# EAGLE design SAME54-board (EAGLE 9.6.2)

## Sheet 1 of 3
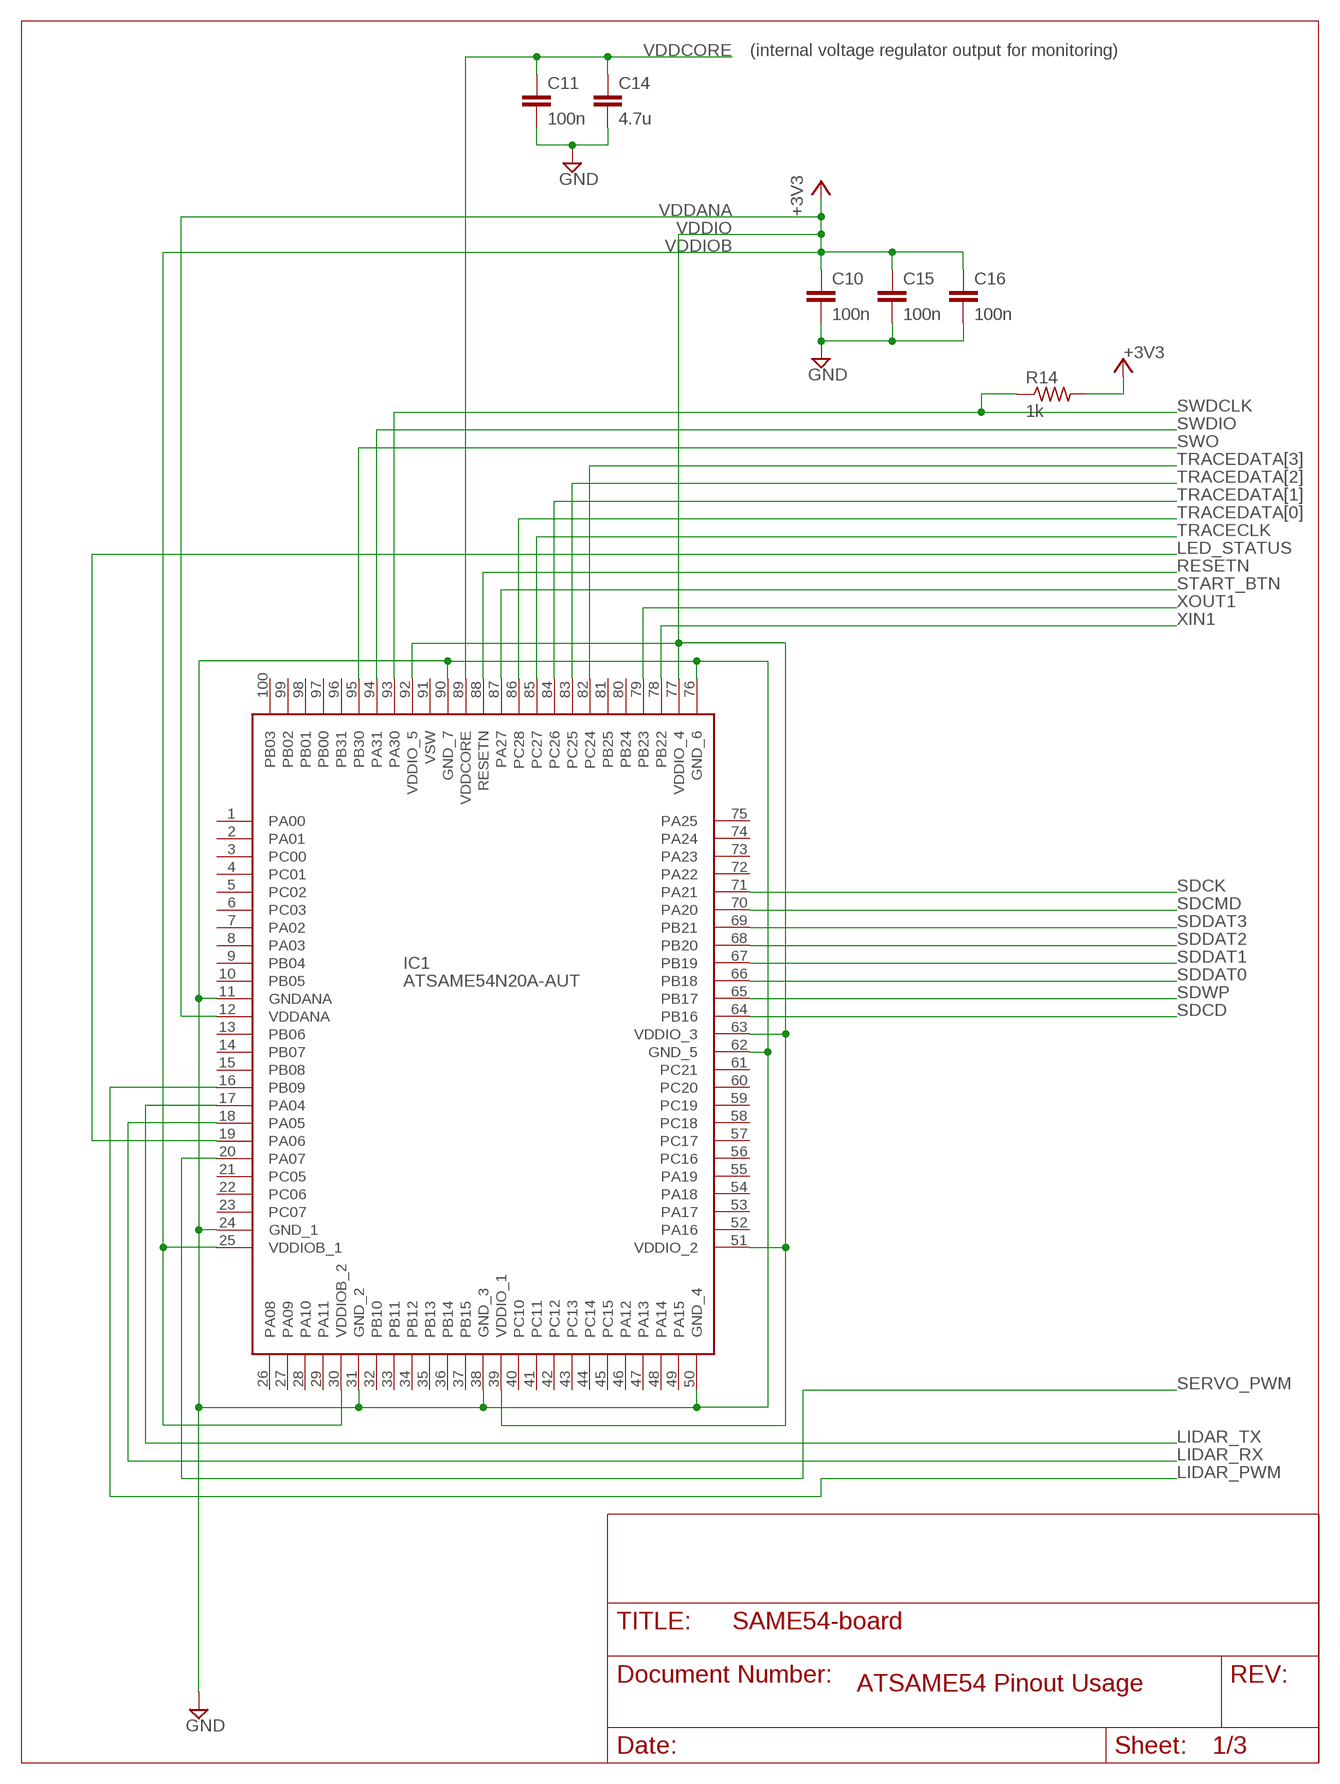
[diagram p0: schematic, sheet 1]

### Parts
C10  100n  C-EUC0603  [C0603]
C11  100n  C-EUC0603  [C0603]
C14  4.7u  C-EUC0603  [C0603]
C15  100n  C-EUC0603  [C0603]
C16  100n  C-EUC0603  [C0603]
IC1  ATSAME54N20A-AUT  [QFP50P1600X1600X120-100N]
R14  1k  R-US_R0603  [R0603]

### Nets
+3V3: C10.1 C15.1 C16.1 IC1.12(VDDANA) IC1.25(VDDIOB_1) IC1.30(VDDIOB_2) IC1.39(VDDIO_1) IC1.51(VDDIO_2) IC1.63(VDDIO_3) IC1.77(VDDIO_4) IC1.92(VDDIO_5) R14.2 ; also sheet 2,3
GND: C10.2 C11.2 C14.2 C15.2 C16.2 IC1.11(GNDANA) IC1.24(GND_1) IC1.31(GND_2) IC1.38(GND_3) IC1.50(GND_4) IC1.62(GND_5) IC1.76(GND_6) IC1.90(GND_7) ; also sheet 2,3
LED_STATUS: IC1.19(PA06) ; also sheet 3
LIDAR_PWM: IC1.16(PB09) ; also sheet 3
LIDAR_RX: IC1.18(PA05) ; also sheet 3
LIDAR_TX: IC1.17(PA04) ; also sheet 3
RESETN: IC1.88(RESETN) ; also sheet 3
SDCD: IC1.64(PB16) ; also sheet 3
SDCK: IC1.71(PA21) ; also sheet 3
SDCMD: IC1.70(PA20) ; also sheet 3
SDDAT0: IC1.66(PB18) ; also sheet 3
SDDAT1: IC1.67(PB19) ; also sheet 3
SDDAT2: IC1.68(PB20) ; also sheet 3
SDDAT3: IC1.69(PB21) ; also sheet 3
SDWP: IC1.65(PB17) ; also sheet 3
SERVO_PWM: IC1.20(PA07) ; also sheet 3
START_BTN: IC1.87(PA27) ; also sheet 3
SWDCLK: IC1.93(PA30) R14.1 ; also sheet 3
SWDIO: IC1.94(PA31) ; also sheet 3
SWO: IC1.95(PB30) ; also sheet 3
TRACECLK: IC1.85(PC27) ; also sheet 3
TRACEDATA[0]: IC1.86(PC28) ; also sheet 3
TRACEDATA[1]: IC1.84(PC26) ; also sheet 3
TRACEDATA[2]: IC1.83(PC25) ; also sheet 3
TRACEDATA[3]: IC1.82(PC24) ; also sheet 3
VDDCORE: C11.1 C14.1 IC1.89(VDDCORE)
XIN1: IC1.78(PB22) ; also sheet 3
XOUT1: IC1.79(PB23) ; also sheet 3
Unconnected: IC1.1(PA00) IC1.2(PA01) IC1.3(PC00) IC1.4(PC01) IC1.5(PC02) IC1.6(PC03) IC1.7(PA02) IC1.8(PA03) IC1.9(PB04) IC1.10(PB05) IC1.13(PB06) IC1.14(PB07) IC1.15(PB08) IC1.21(PC05) IC1.22(PC06) IC1.23(PC07) IC1.26(PA08) IC1.27(PA09) IC1.28(PA10) IC1.29(PA11) IC1.32(PB10) IC1.33(PB11) IC1.34(PB12) IC1.35(PB13) IC1.36(PB14) IC1.37(PB15) IC1.40(PC10) IC1.41(PC11) IC1.42(PC12) IC1.43(PC13) IC1.44(PC14) IC1.45(PC15) IC1.46(PA12) IC1.47(PA13) IC1.48(PA14) IC1.49(PA15) IC1.52(PA16) IC1.53(PA17) IC1.54(PA18) IC1.55(PA19) IC1.56(PC16) IC1.57(PC17) IC1.58(PC18) IC1.59(PC19) IC1.60(PC20) IC1.61(PC21) IC1.72(PA22) IC1.73(PA23) IC1.74(PA24) IC1.75(PA25) IC1.80(PB24) IC1.81(PB25) IC1.91(VSW) IC1.96(PB31) IC1.97(PB00) IC1.98(PB01) IC1.99(PB02) IC1.100(PB03)

### Notes on the sheet
- (internal voltage regulator output for monitoring)
- VDDANA
- VDDIO
- VDDIOB
- ATSAME54 Pinout Usage

## Sheet 2 of 3
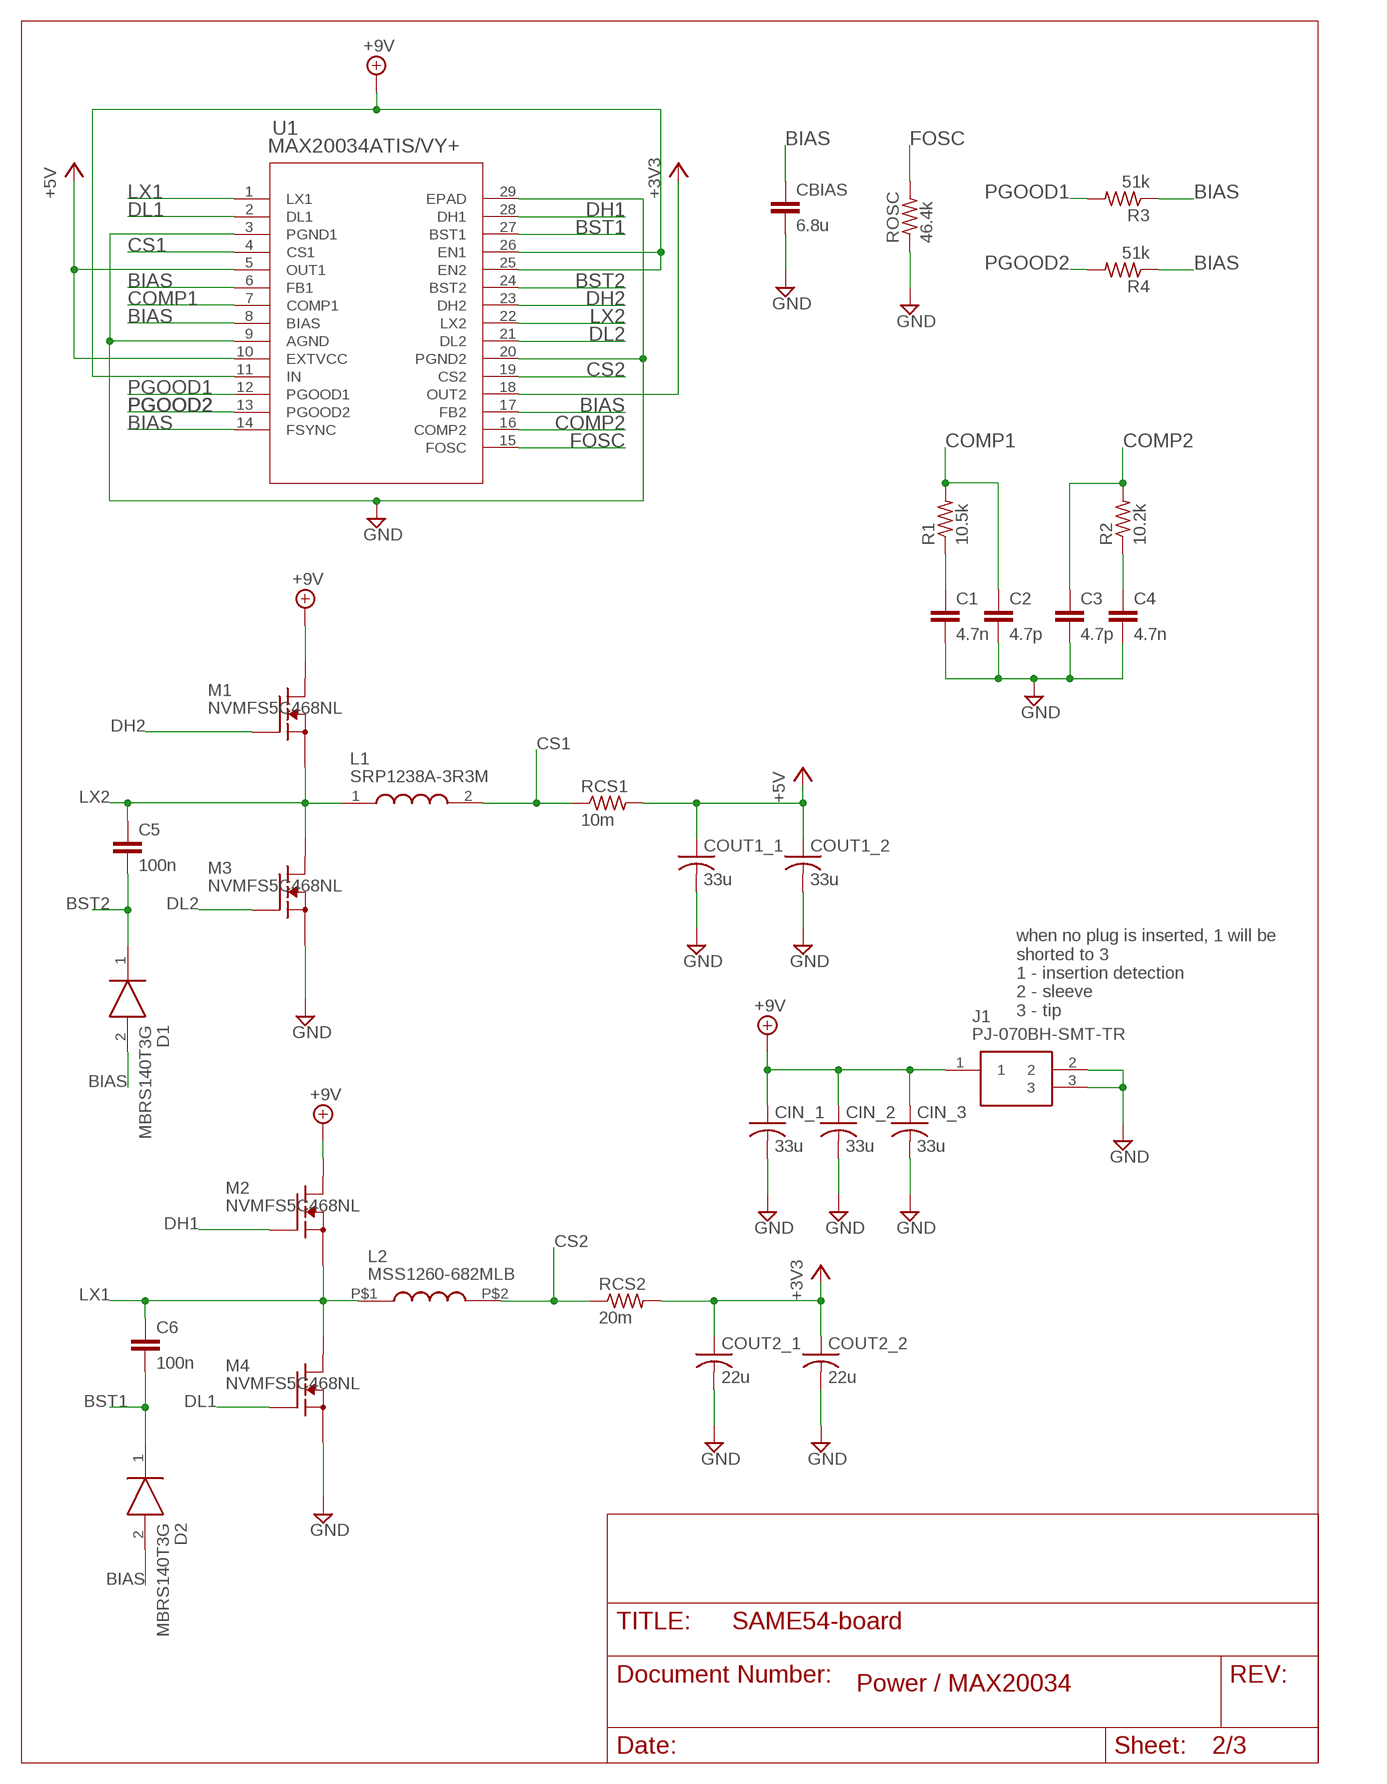
[diagram p1: schematic, sheet 2]

### Parts
C1  4.7n  C-EUC0603  [C0603]
C2  4.7p  C-EUC0402  [C0402]
C3  4.7p  C-EUC0402  [C0402]
C4  4.7n  C-EUC0603  [C0603]
C5  100n  C-EUC0603  [C0603]
C6  100n  C-EUC0603  [C0603]
CBIAS  6.8u  C-EUC1206  [C1206]
CIN_1  33u  C-USC1812  [C1812]
CIN_2  33u  C-USC1812  [C1812]
CIN_3  33u  C-USC1812  [C1812]
COUT1_1  33u  C-USC1812  [C1812]
COUT1_2  33u  C-USC1812  [C1812]
COUT2_1  22u  C-USC1206  [C1206]
COUT2_2  22u  C-USC1206  [C1206]
D1  MBRS140T3G  [DIOM5436X247N]
D2  MBRS140T3G  [DIOM5436X247N]
J1  PJ-070BH-SMT-TR  [PJ070BHSMTTR]
L1  SRP1238A-3R3M  [INDPM135125X350N]
L2  MSS1260-682MLB  [MSS1260]
M1  NVMFS5C468NL  [DFN5_SO-8FL]
M2  NVMFS5C468NL  [DFN5_SO-8FL]
M3  NVMFS5C468NL  [DFN5_SO-8FL]
M4  NVMFS5C468NL  [DFN5_SO-8FL]
R1  10.5k  R-US_R0402  [R0402]
R2  10.2k  R-US_R0402  [R0402]
R3  51k  R-US_R0402  [R0402]
R4  51k  R-US_R0402  [R0402]
RCS1  10m  R-US_R0603  [R0603]
RCS2  20m  R-US_R1206  [R1206]
ROSC  46.4k  R-US_R0402  [R0402]
U1  MAX20034ATIS/VY+  [21-100130_MXM]

### Nets
+3V3: COUT2_1.1 COUT2_2.1 RCS2.2 U1.18(OUT2) ; also sheet 1,3
+5V: COUT1_1.1 COUT1_2.1 RCS1.2 U1.5(OUT1) U1.10(EXTVCC) ; also sheet 3
+9V: CIN_1.1 CIN_2.1 CIN_3.1 J1.1 M1.D1(D) M1.D2(D) M1.D3(D) M1.D4(D) M2.D1(D) M2.D2(D) M2.D3(D) M2.D4(D) U1.11(IN) U1.25(EN2) U1.26(EN1)
BIAS: CBIAS.1 D1.2(A) D2.2(A) R3.1 R4.1 U1.6(FB1) U1.8(BIAS) U1.14(FSYNC) U1.17(FB2)
BST1: C6.2 D2.1(K) U1.27(BST1)
BST2: C5.2 D1.1(K) U1.24(BST2)
COMP1: C2.1 R1.2 U1.7(COMP1)
COMP2: C3.1 R2.2 U1.16(COMP2)
CS1: L1.2 RCS1.1 U1.4(CS1)
CS2: L2.P$2 RCS2.1 U1.19(CS2)
DH1: M2.G U1.28(DH1)
DH2: M1.G U1.23(DH2)
DL1: M4.G U1.2(DL1)
DL2: M3.G U1.21(DL2)
FOSC: ROSC.2 U1.15(FOSC)
GND: C1.2 C2.2 C3.2 C4.2 CBIAS.2 CIN_1.2 CIN_2.2 CIN_3.2 COUT1_1.2 COUT1_2.2 COUT2_1.2 COUT2_2.2 J1.2 J1.3 M3.S1(S) M3.S2(S) M3.S3(S) M4.S1(S) M4.S2(S) M4.S3(S) ROSC.1 U1.3(PGND1) U1.9(AGND) U1.20(PGND2) U1.29(EPAD) ; also sheet 1,3
LX1: C6.1 L2.P$1 M2.S1(S) M2.S2(S) M2.S3(S) M4.D1(D) M4.D2(D) M4.D3(D) M4.D4(D) U1.1(LX1)
LX2: C5.1 L1.1 M1.S1(S) M1.S2(S) M1.S3(S) M3.D1(D) M3.D2(D) M3.D3(D) M3.D4(D) U1.22(LX2)
N$1: C1.1 R1.1
N$3: C4.1 R2.1
PGOOD1: R3.2 U1.12(PGOOD1)
PGOOD2: R4.2 U1.13(PGOOD2)

### Notes on the sheet
- when no plug is inserted, 1 will be 
  shorted to 3
  1 - insertion detection
  2 - sleeve
  3 - tip
- Power / MAX20034

## Sheet 3 of 3
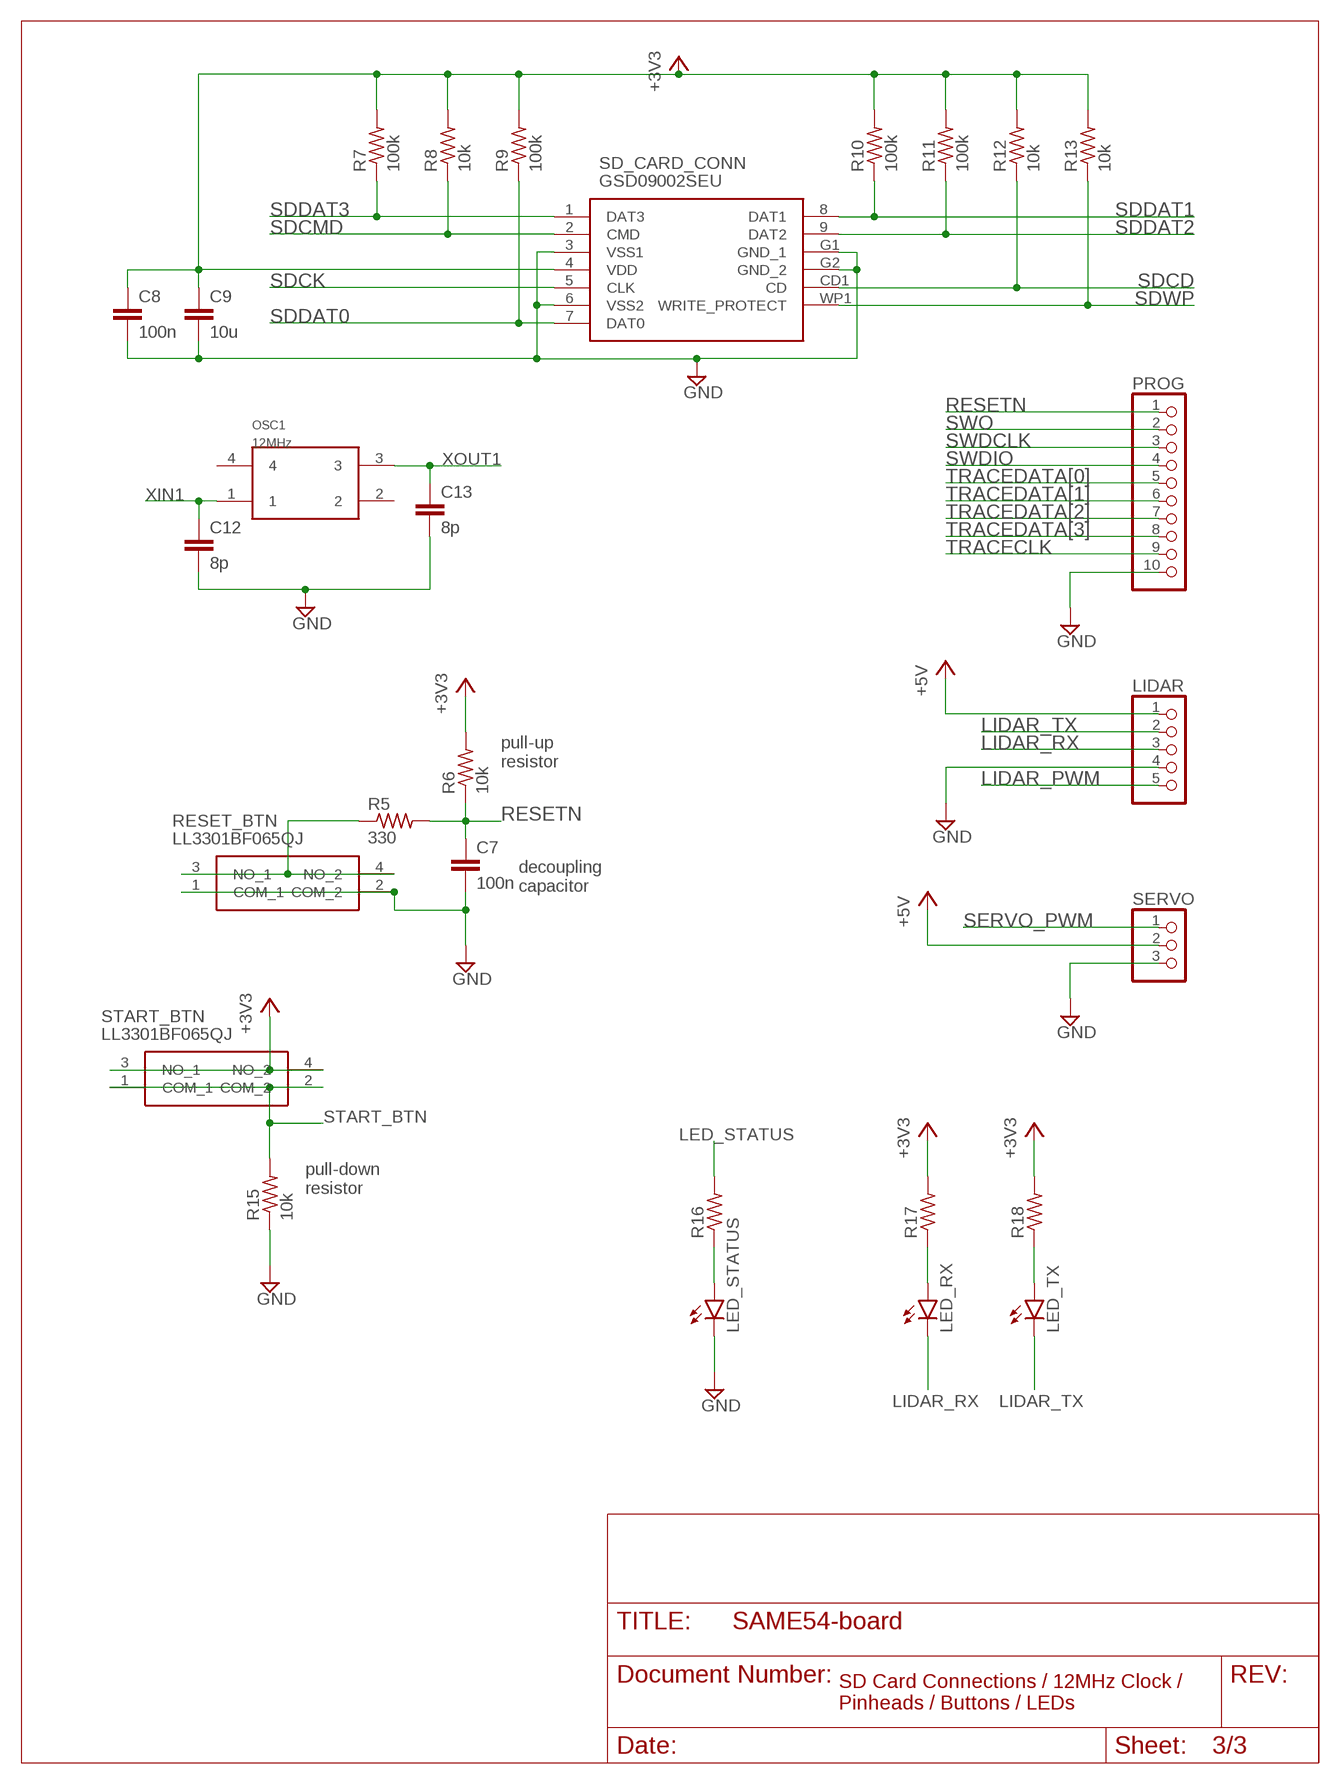
[diagram p2: schematic, sheet 3]

### Parts
C7  100n  C-EUC0603  [C0603]
C8  100n  C-EUC0603  [C0603]
C9  10u  C-EUC0603  [C0603]
C12  8p  C-EUC0603  [C0603]
C13  8p  C-EUC0603  [C0603]
LED_RX  LEDCHIPLED_0603  [CHIPLED_0603]
LED_STATUS  LEDCHIPLED_0603  [CHIPLED_0603]
LED_TX  LEDCHIPLED_0603  [CHIPLED_0603]
LIDAR  PINHD-1X5  [1X05]
OSC1  CX3225CA12000D0KPSC1CX3225CA  [OSCCC320X250X90N]
PROG  PINHD-1X10  [1X10]
R5  330  R-US_R0603  [R0603]
R6  10k  R-US_R0603  [R0603]
R7  100k  R-US_R0603  [R0603]
R8  10k  R-US_R0603  [R0603]
R9  100k  R-US_R0603  [R0603]
R10  100k  R-US_R0603  [R0603]
R11  100k  R-US_R0603  [R0603]
R12  10k  R-US_R0603  [R0603]
R13  10k  R-US_R0603  [R0603]
R15  10k  R-US_R0603  [R0603]
R16  R-US_R0603  [R0603]
R17  R-US_R0603  [R0603]
R18  R-US_R0603  [R0603]
RESET_BTN  LL3301BF065QJ  [LL3301BF065QJ]
SD_CARD_CONN  GSD09002SEU  [GSD09002SEU]
SERVO  PINHD-1X3  [1X03]
START_BTN  LL3301BF065QJ  [LL3301BF065QJ]

### Nets
+3V3: C8.1 C9.1 R6.2 R7.2 R8.2 R9.2 R10.2 R11.2 R12.2 R13.2 R17.2 R18.2 SD_CARD_CONN.4(VDD) START_BTN.3(NO_1) START_BTN.4(NO_2) ; also sheet 1,2
+5V: LIDAR.1 SERVO.2 ; also sheet 2
GND: C7.2 C8.2 C9.2 C12.2 C13.2 LED_STATUS.C LIDAR.4 PROG.10 R15.1 RESET_BTN.1(COM_1) RESET_BTN.2(COM_2) SD_CARD_CONN.3(VSS1) SD_CARD_CONN.6(VSS2) SD_CARD_CONN.G1(GND_1) SD_CARD_CONN.G2(GND_2) SERVO.3 ; also sheet 1,2
LED_STATUS: R16.2 ; also sheet 1
LIDAR_PWM: LIDAR.5 ; also sheet 1
LIDAR_RX: LED_RX.C LIDAR.3 ; also sheet 1
LIDAR_TX: LED_TX.C LIDAR.2 ; also sheet 1
N$2: LED_STATUS.A R16.1
N$4: R5.1 RESET_BTN.3(NO_1) RESET_BTN.4(NO_2)
N$8: LED_RX.A R17.1
N$9: LED_TX.A R18.1
RESETN: C7.1 PROG.1 R5.2 R6.1 ; also sheet 1
SDCD: R12.1 SD_CARD_CONN.CD1(CD) ; also sheet 1
SDCK: SD_CARD_CONN.5(CLK) ; also sheet 1
SDCMD: R8.1 SD_CARD_CONN.2(CMD) ; also sheet 1
SDDAT0: R9.1 SD_CARD_CONN.7(DAT0) ; also sheet 1
SDDAT1: R10.1 SD_CARD_CONN.8(DAT1) ; also sheet 1
SDDAT2: R11.1 SD_CARD_CONN.9(DAT2) ; also sheet 1
SDDAT3: R7.1 SD_CARD_CONN.1(DAT3) ; also sheet 1
SDWP: R13.1 SD_CARD_CONN.WP1(WRITE_PROTECT) ; also sheet 1
SERVO_PWM: SERVO.1 ; also sheet 1
START_BTN: R15.2 START_BTN.1(COM_1) START_BTN.2(COM_2) ; also sheet 1
SWDCLK: PROG.3 ; also sheet 1
SWDIO: PROG.4 ; also sheet 1
SWO: PROG.2 ; also sheet 1
TRACECLK: PROG.9 ; also sheet 1
TRACEDATA[0]: PROG.5 ; also sheet 1
TRACEDATA[1]: PROG.6 ; also sheet 1
TRACEDATA[2]: PROG.7 ; also sheet 1
TRACEDATA[3]: PROG.8 ; also sheet 1
XIN1: C12.1 OSC1.1 ; also sheet 1
XOUT1: C13.1 OSC1.3 ; also sheet 1
Unconnected: OSC1.2 OSC1.4

### Notes on the sheet
- pull-up
  resistor
- decoupling
  capacitor
- pull-down
  resistor
- SD Card Connections / 12MHz Clock /
  Pinheads / Buttons / LEDs

## Library data of the parts
C1-C16 CBIAS = rcl:C-EU: CAPACITOR, European symbol; SPICEPREFIX: C
CIN_1-CIN_3 COUT1_1 COUT1_2 COUT2_1 COUT2_2 = rcl:C-US: CAPACITOR, American symbol; SPICEPREFIX: C
D1 D2 = LAMS_lib:MBRS140T3G: ON SEMICONDUCTOR - MBRS140T3G - Schottky Rectifier, 40 V, 1 A, Single, DO-214AA (SMB), 2 Pins, 600 mV Source: Datasheet <http://www.onsemi.com/pub/Collateral/MBRS140T3-D.PDF>; DESCRIPTION: ON SEMICONDUCTOR - MBRS140T3G - Schottky Rectifier, 40 V, 1 A, Single, DO-214AA (SMB), 2 Pins, 600 mV; HEIGHT: 2.47mm; MANUFACTURER_NAME: ON Semiconductor; MANUFACTURER_PART_NUMBER: MBRS140T3G; MOUSER_PART_NUMBER: 863-MBRS140T3G; MOUSER_PRICE-STOCK: https://www.mouser.co.uk/ProductDetail/ON-Semiconductor/MBRS140T3G?qs=3JMERSakebr7iYT6dCJz%252BA%3D%3D
IC1 = LAMS_lib:ATSAME54N20A-AUT: ARM Microcontrollers - MCU 120MHZ 1024KB FLASH 100 TQFP PKG IN 85C Source: Datasheet <https://www.mouser.com/ds/2/268/60001507A-1130176.pdf>; DESCRIPTION: ARM Microcontrollers - MCU 120MHZ 1024KB FLASH 100 TQFP PKG IN 85C; HEIGHT: 1.2mm; MANUFACTURER_NAME: Microchip; MANUFACTURER_PART_NUMBER: ATSAME54N20A-AUT; MOUSER_PART_NUMBER: 556-ATSAME54N20AAUT; MOUSER_PRICE-STOCK: https://www.mouser.co.uk/ProductDetail/Microchip-Technology/ATSAME54N20A-AUT?qs=HXFqYaX1Q2wziE5NRG3J9w%3D%3D
J1 = LAMS_lib:PJ-070BH-SMT-TR: DC Power Connectors powerjack, 2.5x5.5mm, vertical, SMT, highcurrent, 1switch, T/Rpackaging Source: Datasheet <http://www.cui.com/product/resource/digikeypdf/pj-070bh-smt-tr.pdf>; DESCRIPTION: DC Power Connectors powerjack, 2.5x5.5mm, vertical, SMT, highcurrent, 1switch, T/Rpackaging; HEIGHT: 14mm; MANUFACTURER_NAME: CUI Devices; MANUFACTURER_PART_NUMBER: PJ-070BH-SMT-TR; MOUSER_PART_NUMBER: 490-PJ-070BH-SMT-TR; MOUSER_PRICE-STOCK: https://www.mouser.co.uk/ProductDetail/CUI-Devices/PJ-070BH-SMT-TR?qs=WyjlAZoYn52QG%252BaAz33LnQ%3D%3D
L1 = LAMS_lib:SRP1238A-3R3M: Bourns SRP1238A Series Shielded Wire-wound SMD Inductor with a Carbonyl Powder Core, 3.3 uH +/-20% 12A Idc Source: Datasheet <https://www.bourns.com/docs/Product-Datasheets/SRP1238A.pdf>; DESCRIPTION: Bourns SRP1238A Series Shielded Wire-wound SMD Inductor with a Carbonyl Powder Core, 3.3 uH +/-20% 12A Idc; HEIGHT: 3.5mm; MANUFACTURER_NAME: Bourns; MANUFACTURER_PART_NUMBER: SRP1238A-3R3M; MOUSER_PART_NUMBER: 652-SRP1238A-3R3M; MOUSER_PRICE-STOCK: https://www.mouser.co.uk/ProductDetail/Bourns/SRP1238A-3R3M?qs=7z%252BmIopC6%2FIr03myiJYD%2FQ%3D%3D
L2 = LAMS_lib:MSS1260-682MLB
LED_RX LED_STATUS LED_TX = led:LED: LED OSRAM: - CHIPLED LG R971, LG N971, LY N971, LG Q971, LY Q971, LO R971, LY R971 LH N974, LH R974 LS Q976, LO Q976, LY Q976 LO Q996 - Hyper CHIPLED LW Q18S LB Q993, LB Q99A, LB R99A - SideLED LS A670, LO A670, LY A670, LG A670, LP A670 LB A673, LV A673, LT A673, LW A673 LH A674 LY A675 LS A676, LA A676, LO A676, LY A676, LW A676 LS A679, LY A679, LG A679 - Hyper Micro SIDELED® LS Y876, LA Y876, LO Y876, LY Y876 LT Y87S - SmartLED LW L88C, LW L88S LB L89C, LB L89S, LG L890 LS L89K, LO L89K, LY L89K LS L896, LA L896, LO L896, LY L896 - TOPLED LS T670, LO T670, LY T670, LG T670, LP T670 LSG T670, LSP T670, LSY T670, LOP T670, LYG T670 LG T671, LOG T671, LSG T671 LB T673, LV T673, LT T673, LW T673 LH T674 LS T676, LA T676, LO T676, LY T676, LB T676, LH T676, LSB T676, LW T676 LB T67C, LV T67C, LT T67C, LS T67K, LO T67K, LY T67K, LW E67C LS E67B, LA E67B, LO E67B, LY E67B, LB E67C, LV E67C, LT E67C LW T67C LS T679, LY T679, LG T679 LS T770, LO T770, LY T770, LG T770, LP T770 LB T773, LV T773, LT T773, LW T773 LH T774 LS E675, LA E675, LY E675, LS T675 LS T776, LA T776, LO T776, LY T776, LB T776 LHGB T686 LT T68C, LB T68C - Hyper Mini TOPLED® LB M676 - Mini TOPLED Santana® LG M470 LS M47K, LO M47K, LY M47K Source: http://www.osram.convergy.de LUXEON: - LUMILED® LXK2-PW12-R00, LXK2-PW12-S00, LXK2-PW14-U00, LXK2-PW14-V00 LXK2-PM12-R00, LXK2-PM12-S00, LXK2-PM14-U00 LXK2-PE12-Q00, LXK2-PE12-R00, LXK2-PE12-S00, LXK2-PE14-T00, LXK2-PE14-U00 LXK2-PB12-K00, LXK2-PB12-L00, LXK2-PB12-M00, LXK2-PB14-N00, LXK2-PB14-P00, LXK2-PB14-Q00 LXK2-PR12-L00, LXK2-PR12-M00, LXK2-PR14-Q00, LXK2-PR14-R00 LXK2-PD12-Q00, LXK2-PD12-R00, LXK2-PD12-S00 LXK2-PH12-R00, LXK2-PH12-S00 LXK2-PL12-P00, LXK2-PL12-Q00, LXK2-PL12-R00 Source: www.luxeon.com KINGBRIGHT: KA-3528ASYC Source: www.kingbright.com
LIDAR = pinhead:PINHD-1X5: PIN HEADER
M1-M4 = LAMS_lib:NVMFS5C468NL: MOSFET T6 40V NCH LL IN SO8FL Datasheet <https://www.mouser.com/datasheet/2/308/NVMFS5C468NL-D-1387917.pdf> Features Small Footprint (5x6mm) for Compact Design Low RDS(on) to Minimize Conduction Losses Low QG and Capacitance to Minimize Driver Losses NVMFS5C468NLWF - Wettable Flank Option for Enhanced Optical Inspection AEC-Q101 Qualified and PPAP Capable These Devices are Pb-Free and are RoHS Compliant Specifications Manufacturer: ON Semiconductor VDS voltage: 40V ID current: 37A RDS: 8.6 mOhms VGS voltage: +/- 20V Minimum Operating Temperature: -55 C Maximum Operating Temperature: +175 C Packaging: Cut Tape/Reel
OSC1 = LAMS_lib:CX3225CA12000D0KPSC1: Crystals 12MHz 8pF 3.2x2.5x0.8mm Datasheet <https://www.mouser.com/datasheet/2/909/cx3225ca_e-1316662.pdf> Features Crystal unit for automotive electronics Small and low profile (3.2 x 2.5 x 0.80mm) Cermamic package Reflow compatible Applications ECU High-Speed Automotive Network Specifications Manufacturer: Kyocera Load Capacitance: 8pF Frequency: 12MHz ESR: 200 Ohms Drive Level: 10uW Minimum Operating Temperature: -40 C Maximum Operating Temperature: +85 C Packaging: Cut Tape/Reel
PROG = pinhead:PINHD-1X10: PIN HEADER
R1-R18 RCS1 RCS2 ROSC = rcl:R-US_: RESISTOR, American symbol; SPICEPREFIX: R
RESET_BTN START_BTN = LAMS_lib:LL3301BF065QJ: Pushbutton Switches 50mA 12VDC F065 9.5mm J-Lead Source: Datasheet <http://spec_sheets.e-switch.com/specs/P010455.pdf>; DESCRIPTION: Pushbutton Switches 50mA 12VDC F065 9.5mm J-Lead; HEIGHT: 9.8mm; MANUFACTURER_NAME: E-Switch; MANUFACTURER_PART_NUMBER: LL3301BF065QJ; MOUSER_PART_NUMBER: 612-LL3301BF065QJ; MOUSER_PRICE-STOCK: https://www.mouser.co.uk/ProductDetail/E-Switch/LL3301BF065QJ?qs=QtyuwXswaQgf5j8qoJZz7w%3D%3D
SD_CARD_CONN = LAMS_lib:GSD09002SEU: Memory Card Connectors SD, 9 pos, 15U Source: Datasheet <https://www.arrow.com/en/products/gsd09002seu/amphenol>; DESCRIPTION: Memory Card Connectors SD, 9 pos, 15U; HEIGHT: 2.75mm; MANUFACTURER_NAME: Amphenol; MANUFACTURER_PART_NUMBER: GSD09002SEU; MOUSER_PART_NUMBER: 523-GSD09002SEU; MOUSER_PRICE-STOCK: https://www.mouser.co.uk/ProductDetail/Amphenol-Commercial-Products/GSD09002SEU?qs=J%2Fw1naXNy4LtG6w9y13mdQ%3D%3D
SERVO = pinhead:PINHD-1X3: PIN HEADER
U1 = LAMS_lib:MAX20034ATIS/VY+; MANUFACTURER_PART_NUMBER: MAX20034ATISVY+; VENDOR: Maxim Integrated Products

## Board
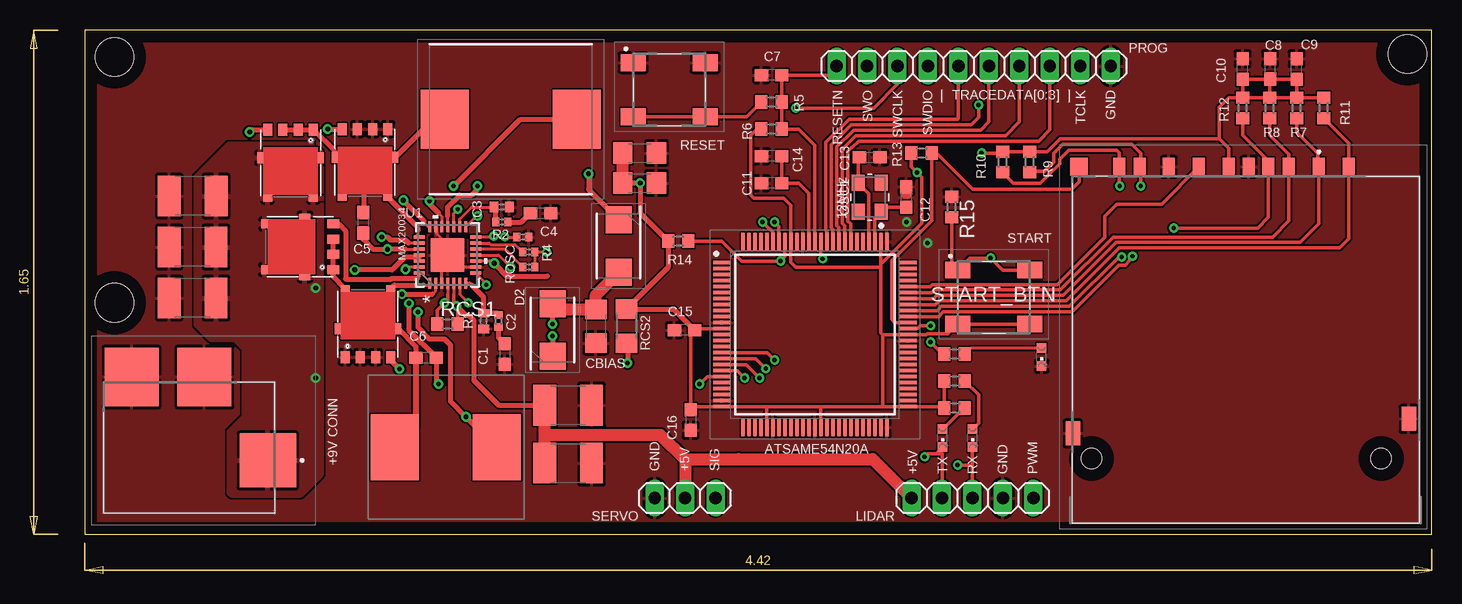
[diagram p3: board, top side]
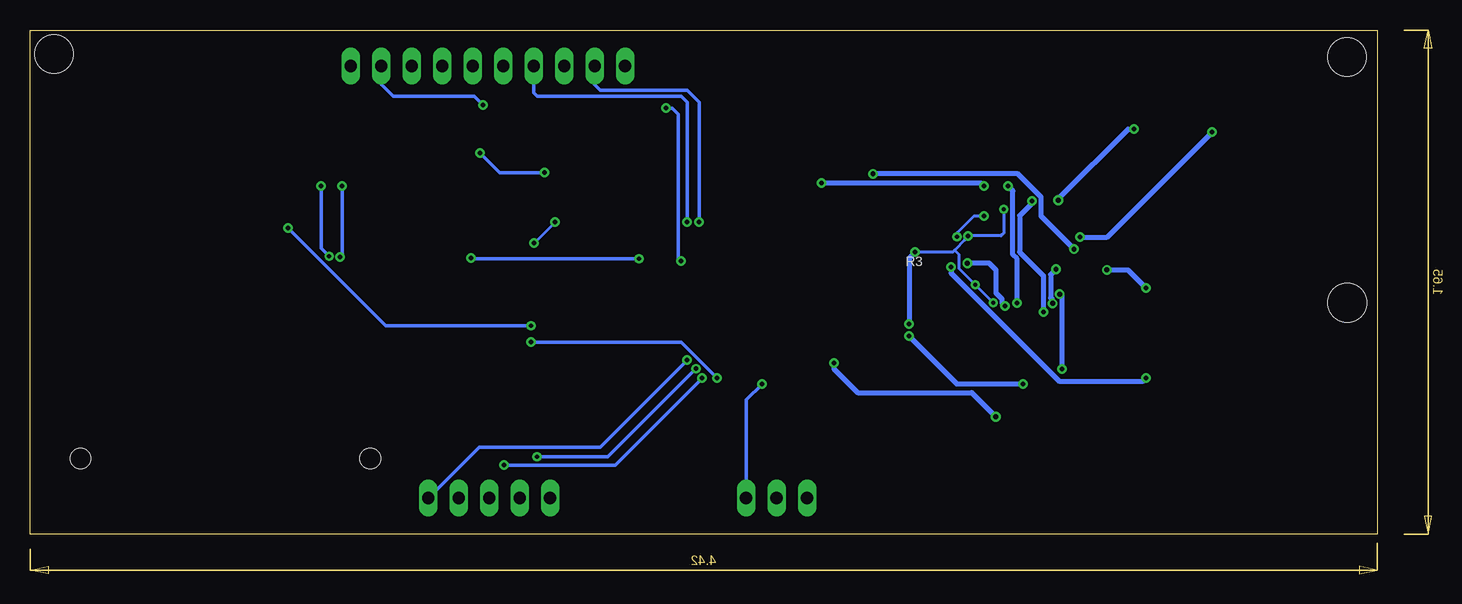
[diagram p4: board, bottom side, seen from below]

Size 112.25 x 42 mm. Coordinates in mm from the lower left corner, seen from the top.
Outline: 0,0 112.25,0 112.25,42 0,42 0,0
Copper layers (1*16): Top 0.035mm / dielectric 1.5mm / Bottom 0.035mm
Design rules "default": minimum track width 6mil, minimum drill 0.35mm, track to track 6mil, track to pad 6mil, pad to pad 6mil, via to via 6mil, smd to smd 6mil, copper to edge 40mil, drill to drill 6mil, minimum pad ring 10mil, minimum via ring 8mil, stop-mask expansion 4mil, vias tented up to drill 0mil, thermal gap 10mil
Holes 3.2 mm at 2.48,19.27 2.5,39.75 110.25,40

### Footprints (pad centres in the part's own frame; a part is rotated, then mirrored left to right if it is on the bottom)
C0603 = smd 1.1 x 1: 1 -0.85,0; 2 0.85,0
C0402 = smd 0.7 x 0.9: 1 -0.65,0; 2 0.65,0
C1206 = smd 1.6 x 1.8: 1 -1.4,0; 2 1.4,0
C1812 = smd 1.9 x 3.4: 1 -1.95,0; 2 1.95,0
DIOM5436X247N = smd 2.25 x 2.15: 1 -2.2,0; 2 2.2,0
QFP50P1600X1600X120-100N = smd 1.475 x 0.3: 1 -7.738,6; 2 -7.738,5.5; 3 -7.738,5; 4 -7.738,4.5; 5 -7.738,4; 6 -7.738,3.5; 7 -7.738,3; 8 -7.738,2.5; 9 -7.738,2; 10 -7.738,1.5; 11 -7.738,1; 12 -7.738,0.5; 13 -7.738,0; 14 -7.738,-0.5; 15 -7.738,-1; 16 -7.738,-1.5; 17 -7.738,-2; 18 -7.738,-2.5; 19 -7.738,-3; 20 -7.738,-3.5; 21 -7.738,-4; 22 -7.738,-4.5; 23 -7.738,-5; 24 -7.738,-5.5; 25 -7.738,-6; 51 7.738,-6; 52 7.738,-5.5; 53 7.738,-5; 54 7.738,-4.5; 55 7.738,-4; 56 7.738,-3.5; 57 7.738,-3; 58 7.738,-2.5; 59 7.738,-2; 60 7.738,-1.5; 61 7.738,-1; 62 7.738,-0.5; 63 7.738,0; 64 7.738,0.5; 65 7.738,1; 66 7.738,1.5; 67 7.738,2; 68 7.738,2.5; 69 7.738,3; 70 7.738,3.5; 71 7.738,4; 72 7.738,4.5; 73 7.738,5; 74 7.738,5.5; 75 7.738,6 | smd 0.3 x 1.475: 26 -6,-7.738; 27 -5.5,-7.738; 28 -5,-7.738; 29 -4.5,-7.738; 30 -4,-7.738; 31 -3.5,-7.738; 32 -3,-7.738; 33 -2.5,-7.738; 34 -2,-7.738; 35 -1.5,-7.738; 36 -1,-7.738; 37 -0.5,-7.738; 38 0,-7.738; 39 0.5,-7.738; 40 1,-7.738; 41 1.5,-7.738; 42 2,-7.738; 43 2.5,-7.738; 44 3,-7.738; 45 3.5,-7.738; 46 4,-7.738; 47 4.5,-7.738; 48 5,-7.738; 49 5.5,-7.738; 50 6,-7.738; 76 6,7.738; 77 5.5,7.738; 78 5,7.738; 79 4.5,7.738; 80 4,7.738; 81 3.5,7.738; 82 3,7.738; 83 2.5,7.738; 84 2,7.738; 85 1.5,7.738; 86 1,7.738; 87 0.5,7.738; 88 0,7.738; 89 -0.5,7.738; 90 -1,7.738; 91 -1.5,7.738; 92 -2,7.738; 93 -2.5,7.738; 94 -3,7.738; 95 -3.5,7.738; 96 -4,7.738; 97 -4.5,7.738; 98 -5,7.738; 99 -5.5,7.738; 100 -6,7.738
PJ070BHSMTTR = smd 4.7 x 4.5: 1 -5.368,2.5 | smd 4.5 x 4.9: 2 -0.067,-4.45; 3 5.982,-4.45
INDPM135125X350N = smd 4 x 4.9: 1 -5.5,0; 2 5.5,0
MSS1260 = smd 5.5 x 4: P$1 0,8.5; P$2 0,0
CHIPLED_0603 = smd 0.8 x 0.8: A 0,-0.75; C 0,0.75
1X05 = drill 1.016 long: 1 -5.08,0; 2 -2.54,0; 3 0,0; 4 2.54,0; 5 5.08,0
DFN5_SO-8FL = smd 0.495 x 0.905: D1 -2.527,2.342; D4 2.527,2.342 | smd 0.75 x 0.575: D2 -1.905,5.707; D3 1.905,5.707 | smd 0.75 x 1: G 1.905,0; S1 -1.905,0; S2 -0.635,0; S3 0.635,0
OSCCC320X250X90N = smd 1.333 x 1.083: 1 -1.2,-0.975; 2 1.2,-0.975; 3 1.2,0.975; 4 -1.2,0.975
1X10 = drill 1.016 long: 1 -11.43,0; 2 -8.89,0; 3 -6.35,0; 4 -3.81,0; 5 -1.27,0; 6 1.27,0; 7 3.81,0; 8 6.35,0; 9 8.89,0; 10 11.43,0
R0402 = smd 0.6 x 0.7: 1 -0.5,0; 2 0.5,0
R0603 = smd 1 x 1.1: 1 -0.85,0; 2 0.85,0
R1206 = smd 1.6 x 1.803: 1 -1.422,0; 2 1.422,0
LL3301BF065QJ = smd 2.1 x 1.4: 1 -3,2.25; 2 3,2.25; 3 -3,-2.25; 4 3,-2.25
GSD09002SEU = smd 1.5 x 1: 1 -14.183,6.3; 2 -14.183,3.8; 3 -14.183,0.45; 4 -14.183,-1.2; 5 -14.183,-3.7; 6 -14.183,-6.2; 7 -14.183,-8.63; 8 -14.183,-10.33; 9 -14.183,8.8; CD1 -14.183,2.1 | smd 2 x 1.2: G1 6.827,13.8; G2 8.027,-14.2 | smd 1.5 x 1.45: WP1 -14.183,-13.68 | hole 1.7: 10.127,11.5; 10.127,-12.65
1X03 = drill 1.016 long: 1 -2.54,0; 2 0,0; 3 2.54,0
21-100130_MXM = smd 0.914 x 0.254: 1 -2.349,1.5; 2 -2.349,1; 3 -2.349,0.5; 4 -2.349,0; 5 -2.349,-0.5; 6 -2.349,-1; 7 -2.349,-1.5; 15 2.349,-1.5; 16 2.349,-1; 17 2.349,-0.5; 18 2.349,0; 19 2.349,0.5; 20 2.349,1; 21 2.349,1.5 | smd 0.254 x 0.914: 8 -1.5,-2.349; 9 -1,-2.349; 10 -0.5,-2.349; 11 0,-2.349; 12 0.5,-2.349; 13 1,-2.349; 14 1.5,-2.349; 22 1.5,2.349; 23 1,2.349; 24 0.5,2.349; 25 0,2.349; 26 -0.5,2.349; 27 -1,2.349; 28 -1.5,2.349 | smd 2.794 x 2.794: 29 0,0

### Placement (x,y rotation side)
C1  35,15 270 top
C2  33.25,17.75 270 top
C3  34.75,27.25 0 top
C4  38,26.75 0 top
C5  23.2,25.94 270 top
C6  28.46,14.7 0 top
C7  57.25,38.25 180 top
C8  98.8,38.76 90 top
C9  101,38.75 90 top
C10  96.5,38.75 90 top
C11  57.25,29.25 180 top
C12  68.49,28.07 90 top
C13  65.43,31.38 0 top
C14  57.25,31.5 180 top
C15  50,17 180 top
C16  50.5,9.5 270 top
CBIAS  42.6,17.31 270 top
CIN_1  9.01,28.16 180 top
CIN_2  9,23.91 180 top
CIN_3  9,19.66 180 top
COUT1_1  40.3,10.74 0 top
COUT1_2  40.3,5.91 0 top
COUT2_1  46.25,31.75 0 top
COUT2_2  46.25,29.25 0 top
D1  44.5,24 270 top
D2  39,17 90 top
IC1  60.85,16.62 0 top
J1  9.91,8.64 180 top
L1  35.5,34.56 0 top
L2  34.33,7.22 90 top
LED_RX  74,8 180 top
LED_STATUS  79.75,14.75 180 top
LED_TX  71.5,8 180 top
LIDAR  73.99,3 0 top
M1  17.16,33.7 180 top
M2  20.7,23.93 90 top
M3  23.36,33.75 180 top
M4  23.61,14.75 0 top
OSC1  65.43,28.07 90 top
PROG  74.09,39 0 top
R1  34.5,17.75 90 top
R2  34.75,26 180 top
R3  37,22.25 180 top
R4  37,23.5 180 top
R5  57.25,36 0 top
R6  57.25,33.75 180 top
R7  101,35.5 90 top
R8  98.75,35.5 90 top
R9  78.75,31 90 top
R10  76.5,31 90 top
R11  103.25,35.5 90 top
R12  96.5,35.5 90 top
R13  69.75,31.75 180 top
R14  49.47,24.41 180 top
R15  72.25,27.25 270 top
R16  72.5,15 180 top
R17  72.5,12.75 180 top
R18  72.5,10.5 180 top
RCS1  30.25,17.5 0 top
RCS2  45.15,17.32 90 top
RESET_BTN  48.71,37.03 0 top
ROSC  36.5,24.75 180 top
SD_CARD_CONN  96.55,16.42 270 top
SERVO  50.04,3 180 top
START_BTN  75.75,19.75 0 top
U1  30.25,23.25 90 top

### Tracks (layer width: path | path; a pad name or v marks a point on that pad's centre or on a via)
+3V3  (via drill 0.35, 0.4 pad 0.8)
  Top 0.254: U1.18 30.25,26.5
  Top 0.305: IC1.12 50.97,17.12 C15.1 50.5,16.65 C16.1 50.77,10.62 IC1.25 56.85,10.62 | IC1.30 56.85,10.62 | IC1.39 61.35,10.62 | 61.35,10.62 56.85,10.62 | 66.5,10.62 IC1.51 71.53,10.62 R18.2 R17.2 | 66.5,10.62 61.35,10.62 | 66.5,16.62 IC1.63 70.15,16.62 70.22,16.68 71.93,16.68 START_BTN.3 START_BTN.4 | 66.5,16.62 66.5,10.62 | IC1.77 66.35,22.5 | 66.35,22.5 66.35,22.25 | 66.35,22.25 66.35,16.77 66.5,16.62 | 66.35,22.25 59.25,22.25 58.85,22.65 IC1.92 58.85,27.4 58.25,28 55.75,28 55.5,28.25 55.5,33.25 56,33.75 R6.2 | 66.35,22.5 69.75,25.9 69.75,29.75 v69.38,30.12 68.9,30.6 R13.2 | v74.75,31.75 76.4,31.75 R10.2 R9.2 80.2,31.85 81.31,32.96 94.54,32.96 | SD_CARD_CONN.4 95.35,32.15 94.54,32.96 | R12.2 C10.1 C8.1 | C8.1 C9.1 R7.2 | R8.2 R12.2 | R8.2 98.75,37.86 C8.1 | R7.2 R11.2 | R8.2 R7.2 | R12.2 95.35,36.35 94.54,35.54 94.54,32.96
  Top 0.406: 30.25,26.5 30.25,27.25 31.25,28.25 32.25,28.25 32.75,28.75 v32.75,29 | COUT2_2.1 v46.29,29.25 46.29,26.74 R14.2 48.62,22.21 RCS2.2 49.11,18.74 C15.1
  Top 1.016: COUT2_2.1 COUT2_1.1
  Bottom 0.305: v69.38,30.12 73.12,30.12 v74.75,31.75
  Bottom 0.406: v32.75,29 33,29.25 v46.29,29.25
+5V  (via drill 0.4 pad 0.8)
  Top 0.254: U1.5 30.75,20 | v34.13,22.57 33.95,22.75 U1.10
  Top 0.305: 30.75,20 30.75,19.25 v31,19 31.1,18.9 RCS1.2
  Top 0.406: v34.13,22.57 34.74,21.96 34.74,21.94 35.19,21.49 38.57,21.49 | v31,19 31.75,18.25 32,18.25 32.44,17.81 32.44,12.81 34.51,10.74 COUT1_1.1
  Top 1.016: COUT1_2.1 38.35,8.25 | 38.35,8.25 COUT1_1.1 | 38.35,8.25 41.01,8.25 41.03,8.27 47.98,8.27 50.04,6.21 | 50.04,6.21 SERVO.2 | 50.04,6.21 54.46,6.21 54.5,6.25 65.66,6.25 LIDAR.1
  Bottom 0.406: v31,19 31.25,19.25 31.25,19.57 31.75,20.08 31.75,22 32.32,22.57 v34.13,22.57
+9V  (via drill 0.4 pad 0.8)
  Top 0.254: v35.5,22.25 34.5,23.25 U1.11
  Top 0.305: U1.26 27.9,23.08 U1.25
  Top 0.406: M1.D2 19.07,30.73 M1.D1 | v22.51,22.01 25.62,22.01 26.69,23.08 27.9,23.08
  Bottom 0.406: v22.51,22.01 20.76,22.01 v19.25,20.5 | v35.5,22.25 35.5,21.75 26.5,12.75 19.5,12.75 v19.25,13
  pour Top: 9.25,29.75 9.25,17.5 10.5,16.25 12.5,16.25 13.25,15.5 13.25,9.75 12,8.5 12,3.5 12.25,3.25 18,3.25 19.75,5 19.75,31.75 19,32.5 12,32.5
BIAS  (via drill 0.35 pad 0.5, 0.4 pad 0.8)
  Top 0.254: U1.17 30.75,26.71 v31.11,27.07 | v34.09,24.84 34,24.75 U1.14 | v38.5,23.5 R4.1 R3.1 | U1.8 33.48,20.87 v33.48,20.77 | U1.6 31.25,20 v31.98,19.27
  Top 0.406: v39,17.5 D2.2
  Top 1.016: D2.2 39.49,18.71 CBIAS.1 42.6,19.9 D1.2
  Bottom 0.254: v31.11,27.07 31.11,25.06 31.34,24.84 v34.09,24.84 34.34,24.58 34.34,24.51 35.19,23.66 | v31.98,19.27 v33.48,20.77 34.82,22.11 34.82,23.28 35.19,23.66 | 35.19,23.66 35.35,23.5 v38.5,23.5
  Bottom 0.406: v38.5,23.5 39,23 v39,17.5
BST1  (via drill 0.4 pad 0.8)
  Top 0.254: U1.27 26.93,22.25 v26.75,22.07
  Top 0.406: v27.03,19.22 27.03,16.99 C6.2 29.31,12.69 v29.5,12.5 | v39,16.5 D2.1
  Bottom 0.406: v27.03,19.22 27.03,19.5 27.2,19.68 27.2,21.61 v26.75,22.07 | v39,16.5 35,12.5 v29.5,12.5
BST2  (via drill 0.4 pad 0.8)
  Top 0.254: 26.75,23.75 U1.24
  Top 0.406: C5.2 23.2,24.55 24,23.75 v25.26,23.75 | 26.75,23.75 26.25,23.75 v25.26,23.75 | v25.26,23.75 v25.25,23.74 | v42,30.01 42,28.7 D1.1
  Bottom 0.406: v25.25,23.74 27.99,26.48 27.99,28.06 29.94,30.01 v42,30.01
COMP1
  Top 0.254: 32.25,20.75 32.1,20.9 U1.7
  Top 0.406: R1.2 34.35,18.4 C2.1 33.25,19.75 32.25,20.75
COMP2
  Top 0.254: U1.16 31.25,26.25 32.25,27.25 C3.1
  Top 0.406: R2.2 34.25,27.1 C3.1
CS1  (via drill 0.4 pad 0.8)
  Top 0.254: U1.4 30.25,20
  Top 0.305: 30.25,20 30.25,19.5 v30,19.25 29.4,18.65 RCS1.1
  Top 0.406: v30.75,29 36.31,34.56 L1.2
  Top 1.016: 40.85,34.41 L1.2
  Bottom 0.406: v30,19.25 30,22.92 30.35,23.27 30.35,28.6 v30.75,29
CS2  (via drill 0.4 pad 0.8)
  Top 0.254: 29.5,26.75 29.75,26.5 U1.19
  Top 0.406: v27.79,18.5 27.79,17.21 28.75,16.25 30,16.25 30.5,15.75 30.5,11.05 v31.77,9.78 L2.P$2 | v28.75,27.75 28.75,27.5 29.5,26.75 | RCS2.1 45.25,15.8 v45.25,14.25
  Bottom 0.406: v27.79,18.5 27.79,21.5 29.79,23.5 29.79,26.54 28.75,27.58 v28.75,27.75 | v31.77,9.78 33.77,11.78 43.27,11.78 45.25,13.75 v45.25,14.25
DH1
  Top 0.254: 27.75,21.31 27.9,21.46 U1.28
  Top 0.406: M2.G 21.16,25.84 21.75,25.25 21.75,21.25 25.52,21.25 25.58,21.31 27.75,21.31
DH2  (via drill 0.4 pad 0.8)
  Top 0.254: U1.23 27,24.25
  Top 0.406: 27,24.25 26.75,24.5 25.5,24.5 25.25,24.75 v24.75,24.75 | v13.75,33.5 13.95,33.7 M1.G
  Bottom 0.406: v24.75,24.75 22.5,24.75 v13.75,33.5
DL1  (via drill 0.4 pad 0.8)
  Top 0.254: 29,20 29.25,20.25 U1.2
  Top 0.406: M4.G 25.52,14.48 v26.25,13.75 | v26.45,19.99 28.99,19.99 29,20
  Bottom 0.406: v26.25,13.75 26.25,19.8 v26.45,19.99
DL2  (via drill 0.4 pad 0.8)
  Top 0.254: 28.25,26 28.65,25.6 U1.21
  Top 0.406: v20.25,33.75 M3.G | v26.57,27.82 28.25,26.13 28.25,26
  Bottom 0.406: v26.57,27.82 26.43,27.95 26.43,28.07 20.75,33.75 v20.25,33.75
FOSC  (via drill 0.35 pad 0.5)
  Top 0.254: U1.15 32.65,26.5 v32.75,26.5 | v35,24.78 35.03,24.75 ROSC.2
  Bottom 0.254: v35,24.78 v34.99,24.79 34.99,25.11 33.6,26.5 v32.75,26.5
GND  (via drill 0.35)
  Top 0.254: U1.3 29.75,22.75 U1.29 | U1.9 31.25,22.25 U1.29 | U1.20 29.34,25.51 29.34,25.03 30.25,24.12 U1.29
  Top 1.016: C12.2 68.49,28.43
  Bottom 0.254: v68.5,26 v70.25,24.25
  pour Top (rank 6): 0.25,42.25 112.5,42.25 112.5,0.25 -0.25,0.25 -0.25,41.75
LED_STATUS  (via drill 0.35)
  Top 0.305: IC1.19 54.38,13.62 v55,13 | v70.5,16 71.5,15 R16.2
  Bottom 0.305: v55,13 58,16 v70.5,16
LIDAR_PWM  (via drill 0.35)
  Top 0.305: IC1.16 56.88,15.12 v57.5,14.5
  Bottom 0.305: v57.5,14.5 64.75,7.25 74.82,7.25 LIDAR.5
LIDAR_RX  (via drill 0.35)
  Top 0.305: LIDAR.3 73.99,5.75 | 73.99,5.75 LED_RX.C | IC1.18 55.13,14.12 v56.25,13 | 72.98,5.75 v72.75,5.75 73.99,5.75
  Bottom 0.305: v56.25,13 63.5,5.75 v72.75,5.75
LIDAR_TX  (via drill 0.35)
  Top 0.305: LED_TX.C 70.95,6.7 | LIDAR.2 71.45,6.7 70.95,6.7 | IC1.17 55.91,14.62 v56.75,13.79 | v70,6.43 70.27,6.7 70.95,6.7
  Bottom 0.305: v56.75,13.79 64.1,6.43 v70,6.43
LX1
  Top 0.254: 28.25,20.75 28.6,20.75 U1.1
  Top 0.406: M2.S3 M2.S2 M2.S1 20.7,21.46 M4.D2 21.7,18.5 | M4.D1 21.7,17.71 21.7,18.5 | 25.52,18.5 M4.D3 25.81,20.75 28.25,20.75 | 25.52,18.5 25.52,17.71 M4.D4 27.61,15.62 C6.1 | 25.52,18.5 21.7,18.5
  Top 0.508: C6.1 27.61,9 L2.P$1
LX2
  Top 0.254: 27.75,25.25 27.75,24.9 U1.22
  Top 0.406: M1.S3 M1.S2 M1.S1 20.83,31.93 M3.D4 21.45,30.79 21.45,29.75 | 23.32,26.91 C5.1 23.25,26.84 23.25,29.75 | 27.75,25.25 27.75,25.56 M3.D2 25.27,29.75 | M3.D3 21.45,29.75 | 25.27,29.75 25.27,30.79 M3.D1 29.04,34.56 L1.1 | 21.45,29.75 23.25,29.75 | 23.25,29.75 25.27,29.75
N$1
  Top 0.406: C1.1 34.5,16.35 R1.1
N$2
  Top 0.254: LED_STATUS.A 73.85,15.5 R16.1
N$3
  Top 0.406: R2.1 36.4,26 C4.1
N$4
  Top 0.305: RESET_BTN.3 RESET_BTN.4 55.18,34.78 R5.1
N$8
  Top 0.305: LED_RX.A 74.5,9.25 74.5,11.6 R17.1
N$9
  Top 0.305: R18.1 73.25,10.5 LED_TX.A
PGOOD1
  Top 0.254: U1.12 32.63,23.71 35.04,23.71 R3.2
PGOOD2
  Top 0.254: U1.13 33.7,24.25 33.83,24.12 35.88,24.12 R4.2
RESETN
  Top 0.305: PROG.1 61.91,38.25 C7.1 R5.2 R6.1 59.5,33.75 60.85,32.4 IC1.88
SDCD  (via drill 0.35)
  Top 0.305: IC1.64 68.63,17.16 69.45,17.16 69.65,17.37 v70.5,17.37 | v90.75,25.5 97.75,25.5 98.65,26.4 SD_CARD_CONN.CD1 98.65,31.1 96.5,33.25 R12.1
  Bottom 0.305: v70.5,17.37 82.62,17.37 v90.75,25.5
SDCK
  Top 0.305: IC1.71 70.46,20.62 70.63,20.79 81.04,20.79 85,24.75 85,26.5 86,27.5 89.75,27.5 SD_CARD_CONN.5
SDCMD
  Top 0.305: IC1.70 70.6,20.12 70.82,20.33 81.29,20.33 85.71,24.75 99,24.75 100.35,26.1 SD_CARD_CONN.2 100.35,31.65 98.75,33.25 R8.1
SDDAT0  (via drill 0.35)
  Top 0.305: IC1.66 71.19,18.12 71.57,18.5 82.29,18.5 86.18,22.4 86.7,22.4 87.1,22.8 87.1,22.93 v87.33,23.15 | v88,29 88,30.52 | 88,30.52 SD_CARD_CONN.7 | R9.1 78.85,30.25 80,30.25 80.75,31 80.75,31.75 81.5,32.5 87.25,32.5 88,31.75 88,30.52
  Bottom 0.305: v87.33,23.15 88,23.82 v88,29
SDDAT1  (via drill 0.35)
  Top 0.305: IC1.67 71.04,18.62 71.38,18.96 82.04,18.96 86.16,23.08 v86.42,23.08 | v86.25,29 86.22,29.03 SD_CARD_CONN.8 86.22,31.78 86,32 82,32 81.25,31.25 81.25,30.85 79.65,29.25 77.4,29.25 R10.1
  Bottom 0.305: v86.42,23.08 86.25,23.25 v86.25,29
SDDAT2
  Top 0.305: IC1.68 70.9,19.12 71.19,19.42 81.79,19.42 86.21,23.84 104.59,23.84 105.35,24.6 SD_CARD_CONN.9 105.35,32.55 R11.1
SDDAT3
  Top 0.305: IC1.69 70.75,19.62 71.01,19.88 81.54,19.88 85.96,24.29 101.29,24.29 102.85,25.85 SD_CARD_CONN.1 102.75,30.7 102.75,31.75 101,33.5 R7.1
SDWP
  Top 0.305: IC1.65 67.52,17.62 67.25,17.89 67.25,22.75 70.6,26.1 R13.1 71,31.75 74,28.75 82.25,28.75 82.87,29.37 SD_CARD_CONN.WP1
SERVO_PWM  (via drill 0.35)
  Top 0.305: IC1.20 51.87,13.12 v51.25,12.5
  Bottom 0.305: v51.25,12.5 52.58,11.17 SERVO.1
START_BTN  (via drill 0.35)
  Top 0.305: IC1.87 61.35,23.08 v61.5,22.93 | R15.2 72.25,22.5 START_BTN.1 73.75,23 v75.5,23 76.5,22 START_BTN.2
  Bottom 0.305: v61.5,22.93 75.43,22.93 v75.5,23
SWDCLK  (via drill 0.35)
  Top 0.305: R14.1 53.09,24.41 54.75,22.75 v58,22.75 58.35,23.1 IC1.93 | v59.25,35.5 65.75,35.5 67.74,37.49 PROG.3
  Bottom 0.305: v58,22.75 58.25,23 58.25,35 58.75,35.5 v59.25,35.5
SWDIO  (via drill 0.35)
  Top 0.305: IC1.94 57.85,25.65 v57.5,26
  Bottom 0.305: v57.5,26 57.5,36 58,36.5 70,36.5 70.28,36.78 PROG.4
SWO  (via drill 0.35)
  Top 0.305: v56.5,26 57.1,25.4 57.13,25.4 57.35,25.18 IC1.95
  Bottom 0.305: v56.5,26 56.5,36 57.5,37 64.75,37 65.25,37.5 65.25,38.95 PROG.2
TRACECLK  (via drill 0.35)
  Top 0.305: IC1.85 62.35,25.4 62.24,25.51 62.24,32.46 63.9,34.12 73.87,34.12 74.5,34.75 v74.5,35.75
  Bottom 0.305: v74.5,35.75 75.25,36.5 82,36.5 83,37.5 83,38.98 PROG.9
TRACEDATA[0]
  Top 0.305: IC1.86 61.85,25.25 61.78,25.32 61.78,32.65 63.71,34.58 72.75,34.58 72.82,34.65 PROG.5
TRACEDATA[1]
  Top 0.305: IC1.84 62.85,25.54 62.69,25.7 62.69,32.27 64.09,33.66 74.69,33.66 75.36,34.34 PROG.6
TRACEDATA[2]
  Top 0.305: IC1.83 63.35,25.69 63.15,25.89 63.15,32.08 64.28,33.21 76.75,33.21 77.9,34.36 PROG.7
TRACEDATA[3]
  Top 0.305: IC1.82 63.85,25.84 63.61,26.08 63.61,31.89 63.9,32.19 63.94,32.19 64.5,32.75 79.5,32.75 80.44,33.69 PROG.8
VDDCORE
  Top 0.305: C14.1 C11.1 59.5,29.25 60.35,28.4 IC1.89
XIN1
  Top 0.305: IC1.78 65.85,26.32 OSC1.1 66.75,27.22 C12.1
XOUT1
  Top 0.305: IC1.79 65.35,28.38 OSC1.3 64.45,31.25 C13.1

### Text on the board
tPlace: PROG | RESETN | SWO | SWCLK | SWDIO | | TRACEDATA[0:3] | | TCLK | GND | RESET | 12MHz | MAX20034 | START | +9V CONN | ATSAME54N20A | GND | +5V | SIG | +5V | TX | RX | GND | PWM | SERVO | LIDAR